# Altium schematic sheet PowerSupply.SchDoc
size A4
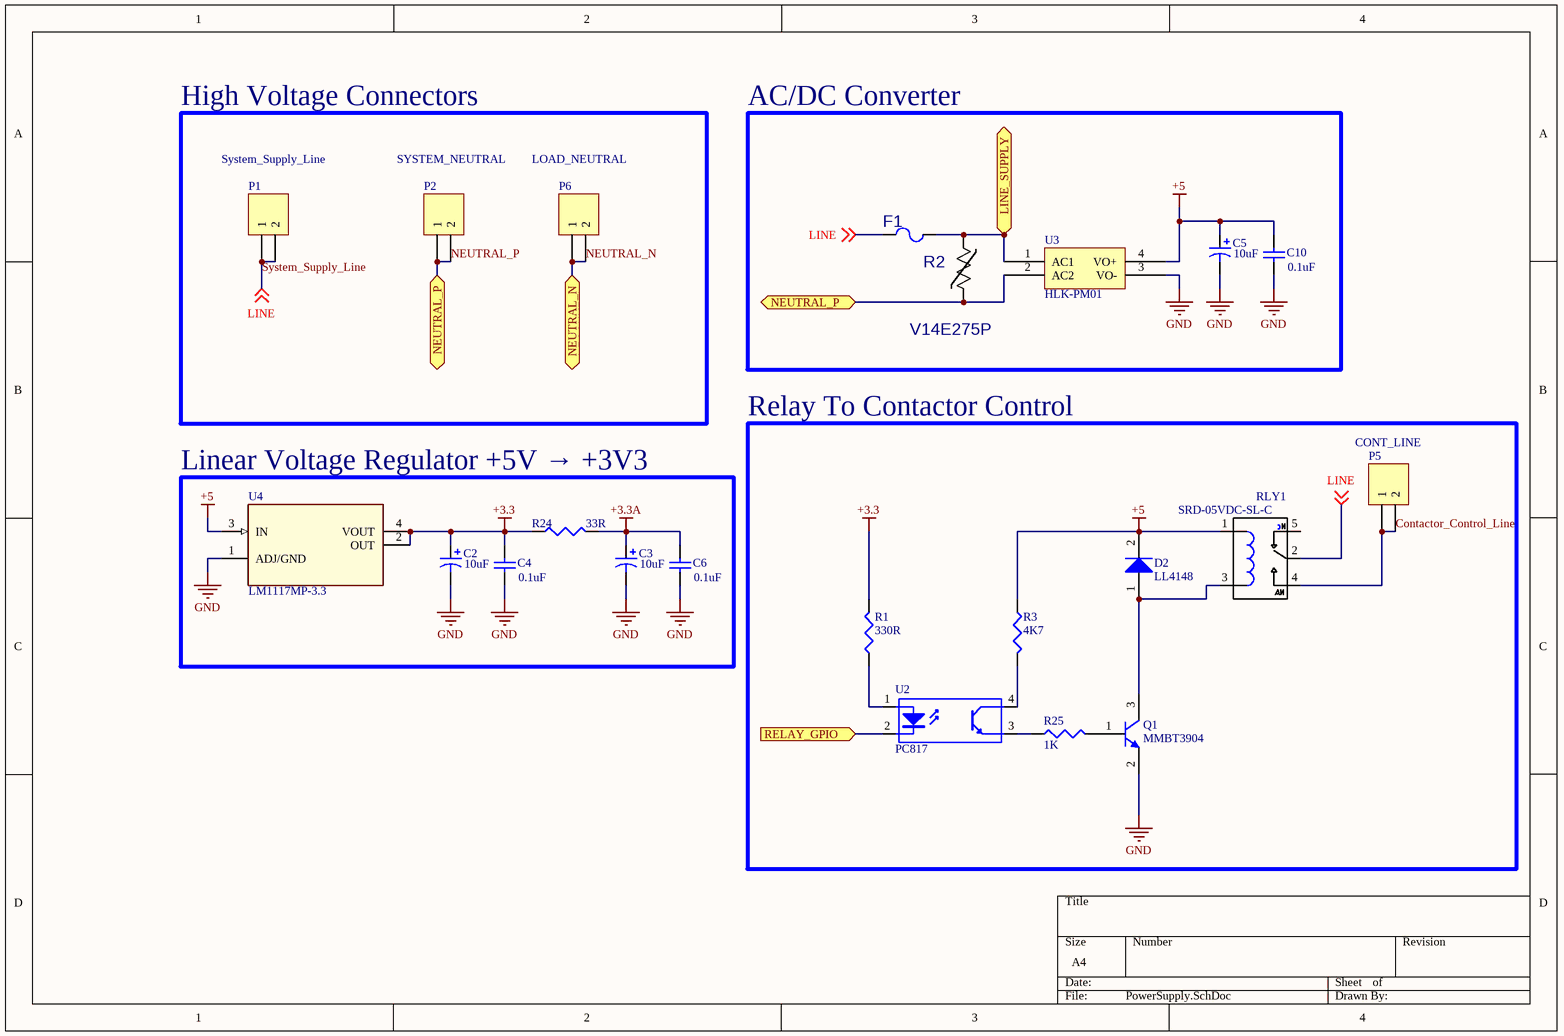
[diagram p0: PowerSupply.SchDoc]

## Parts
C2  value 10uF  [EEE-1VA100WR]  (hidden comment: Cap Pol1)
C3  value 10uF  [EEE-1VA100WR]  (hidden comment: Cap Pol1)
C4  value 0.1uF  [C0603]  (hidden comment: MUDAR FOOTPRINT)
C5  value 10uF  [EEE-1VA100WR]  (hidden comment: Cap Pol1)
C6  value 0.1uF  [C0603]  (hidden comment: MUDAR FOOTPRINT)
C10  value 0.1uF  [C0603]  (hidden comment: MUDAR FOOTPRINT)
D2  LL4148  [LL4148]
F1  RSTA 1 AMMO  [RSTA]  (value not drawn)
P1  System_Supply_Line  [1993763]
P2  SYSTEM_NEUTRAL  [1993763]
P5  CONT_LINE  [1993763]
P6  LOAD_NEUTRAL  [1993763]
Q1  MMBT3904  [SOT-233]
R1  value 330R  [R0603]  (hidden comment: Res3)
R2  value V14E275P  [VARISTOR]  (hidden comment: ERZ-V14D431)
R3  value 4K7  [R0603]  (hidden comment: Res3)
R24  value 33R  [R0603]  (hidden comment: Res3)
R25  value 1K  [R0603]  (hidden comment: Res3)
RLY1  SRD-05VDC-SL-C  [srd-05vdc]
U2  PC817  [SOT254P975X400-4N]
U3  HLK-PM01  [HLK-PM01]
U4  LM1117MP-3.3  [LM1117]

## Blocks framed on the sheet
High Voltage Connectors: P1 P2 P6
AC/DC Converter: C5 C10 F1 R2 U3
Relay To Contactor Control: D2 P5 Q1 R1 R3 R25 RLY1 U2
Linear Voltage Regulator +5V → +3V3: C2-C4 C6 R24 U4

## Ports
LINE_SUPPLY (bidir), NEUTRAL_N (bidir), NEUTRAL_P (bidir), RELAY_GPIO (in)

## Nets
+3.3: C2.1 C4.2 R1.2 R24.1 U4.2(OUT) U4.4(VOUT)
+3.3A: C3.1 C6.2 R24.2
+5: C5.1 C10.2 D2.2(K) R3.1 RLY1.1 U3.4(VO+) U4.3(IN)
GND: C2.2 C3.2 C4.1 C5.2 C6.1 C10.1 Q1.2(E) U3.3(VO-) U4.1(ADJ/GND)
Contactor_Control_Line: P5.1 P5.2 RLY1.4
LINE_SUPPLY: F1.2 R2.1 U3.1(AC1) ; port LINE_SUPPLY
NEUTRAL_N: P6.1 P6.2 ; port NEUTRAL_N
NEUTRAL_P: P2.1 P2.2 R2.2 U3.2(AC2) ; port NEUTRAL_P
RELAY_GPIO: U2.2(K) ; port RELAY_GPIO
System_Supply_Line: F1.1 P1.1 P1.2 RLY1.2 ; off-sheet LINE  [also labelled LINE]
NetD2_1: D2.1(A) Q1.3(C) RLY1.3
NetQ1_1: Q1.1(B) R25.2
NetR1_1: R1.1 U2.1(A)
NetR3_2: R3.2 U2.4(C)
NetR25_1: R25.1 U2.3(E)

Not connected (* = marked no-connect by the designer): RLY1 5

## Library data of the parts
C2 C3 C5 = Cap Pol1: Polarized Capacitor (Radial); Published: 8-Jun-2000; LatestRevisionDate: 17-Jul-2002; LatestRevisionNote: Re-released for DXP Platform.; PackageReference: RB7.6-15; Publisher: Altium Limited; PackageDescription: Polarized Capacitor (Radial); 2 Leads
C4 C6 C10 = Cap Semi: Capacitor (Semiconductor SIM Model); Published: 8-Jun-2000; LatestRevisionDate: 29-May-2009; LatestRevisionNote: IPC-7351 Footprint Added.; PackageReference: C1206; Publisher: Altium Limited; PackageDescription: Chip Capacitor
D2 = Diode: Default Diode; Published: 8-Jun-2000; LatestRevisionDate: 17-Jul-2002; LatestRevisionNote: Re-released for DXP Platform.; PackageVersion: Sep-1996; PackageReference: SMC; Publisher: Altium Limited; PackageDescription: DO-214-AB/SMC; 2 C-Bend Leads; Body 7.9 x 5.9 mm, inc. leads (LxW); Code_JEDEC: DO-214-AB
F1 = RSTA 1 AMMO: Built_By: EMA_UL_Team; Vendor: BelFuse; Value: RSTA 1 AMMO; Manufacturer_Part_Number: RSTA 1 AMMO
P1 P2 P5 P6 = Header 2: Header, 2-Pin; LatestRevisionDate: 17-Jul-2002; LatestRevisionNote: Re-released for DXP Platform.; Publisher: Altium Limited
Q1 = NPN: NPN Bipolar Transistor; Published: 8-Jun-2000; LatestRevisionDate: 17-Jul-2002; LatestRevisionNote: Re-released for DXP Platform.; PackageReference: TO-226-AA; Publisher: Altium Limited; PackageDescription: TO, Flat Index; 3 In-Line, Axial Leads; Body Dia. 4.8mm; Leads 0.55 x 0.51 mm (max); Code_JEDEC: TO-226-AA
R1 R3 R24 R25 = Res3: Resistor; Published: 8-Jun-2000; LatestRevisionDate: 29-May-2009; LatestRevisionNote: IPC-7351 Footprint Added.; PackageReference: J1-0603; Publisher: Altium Limited; PackageDescription: Chip Resistor
R2 = ERZ-V14D431: C: Copyright (C) 2015 Accelerated Designs. All rights reserved; Vendor: Panasonic; Built_By: EMA_UL_Team; Manufacturer_Part_Number: ERZ-V14D431
RLY1 = SRD-05VDC-SL-C: 5V Trigger Relay Module For Arduino And Raspberry Pi 5V Trigger Relay Module For Arduino And Raspberry Pi; MF: MCM Electronics; Price: None; MP: SRD-05VDC-SL-C; Package: None; Availability: Unavailable; SnapEDA_Link: https://www.snapeda.com/parts/SRD-05VDC-SL-C/MCM%20Electronics/view-part/?ref=snap; Value: *
U2 = Optoisolator1: 4-Pin Phototransistor Optocoupler; Published: 24-Mar-1999; LatestRevisionDate: 04-Mar-2005; LatestRevisionNote: Sch pins 3 & 4 Swapped.; DatasheetVersion: Nov-2003; PackageReference: DIP-4; Publisher: Altium Limited
U4 = LM1117MP-3.3: LDO Regulator Pos 3.3V 0.8A 4-Pin_3+Tab_ SOT-223 T/R; MF: Texas Instruments; Package: SOT-223 Texas Instruments; MP: LM1117MP-3.3; Availability: Good; SnapEDA_Link: https://www.snapeda.com/parts/LM1117MP-3.3/Texas%20Instruments/view-part/?ref=snap; Price: 0.62 USD; Value: *